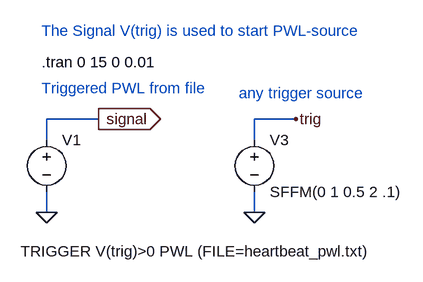
[diagram p0: schematic trigger_pwl_file.asc]
trigger_pwl_file.asc, the LTspice schematic file:
Version 4
SHEET 1 1896 960
WIRE -32 -544 -112 -544
WIRE 272 -544 208 -544
WIRE -112 -512 -112 -544
WIRE 208 -512 208 -544
WIRE -112 -400 -112 -432
WIRE 208 -400 208 -432
FLAG -112 -400 0
FLAG -32 -544 signal
IOPIN -32 -544 Out
FLAG 208 -400 0
FLAG 272 -544 trig
SYMBOL voltage -112 -528 R0
WINDOW 123 0 0 Left 0
WINDOW 39 0 0 Left 0
WINDOW 3 -40 188 Left 0
SYMATTR InstName V1
SYMATTR Value TRIGGER V(trig)>0 PWL (FILE=heartbeat_pwl.txt)
SYMBOL voltage 208 -528 R0
WINDOW 123 0 0 Left 0
WINDOW 39 0 0 Left 0
SYMATTR InstName V3
SYMATTR Value SFFM(0 1 0.5 2 .1)
TEXT -120 -632 Left 0 !.tran 0 15 0 0.01
TEXT -120 -592 Left 0 ;Triggered PWL from file
TEXT 184 -584 Left 0 ;any trigger source
TEXT -120 -680 Left 0 ;The Signal V(trig) is used to start PWL-source

The netlist it stands for:
* trigger_pwl_file.asc
V1 signal 0 TRIGGER V(trig)>0 PWL (FILE=heartbeat_pwl.txt)
V3 trig 0 SFFM(0 1 0.5 2 .1)
.tran 0 15 0 0.01
* Triggered PWL from file
* any trigger source
* The Signal V(trig) is used to start PWL-source
.backanno
.end